# Altium project TP1_NODO_WIFI_R0.PrjPcb
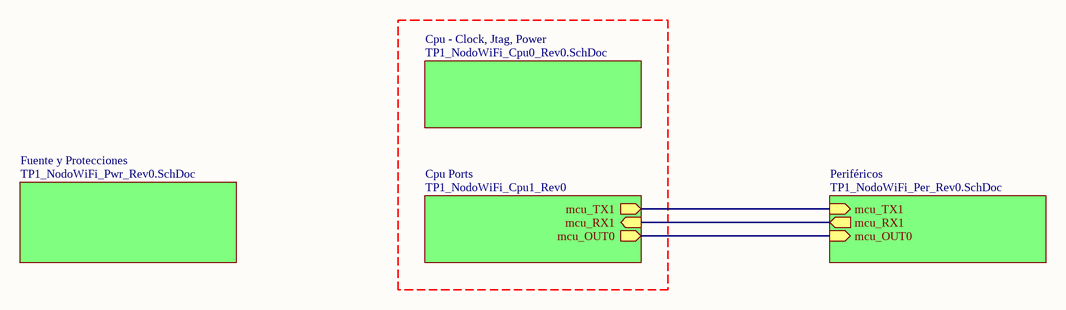
[diagram p0: TP1_NodoWiFi_blk_Rev0.SchDoc]
5 sheets, 52 parts. Net scope: hierarchical (ports join the sheet entries above them; power ports are global).
Board files: TP1_NodoWiFi_Rev0.PcbDoc, TP1_NodoWiFi_Rev0_v22_panel.PcbDoc
Sheets:
  TP1_NodoWiFi_blk_Rev0.SchDoc
    Fuente y Protecciones = TP1_NodoWiFi_Pwr_Rev0.SchDoc
    Cpu Ports = TP1_NodoWiFi_Cpu1_Rev0.SchDoc
    Cpu - Clock, Jtag, Power = TP1_NodoWiFi_Cpu0_Rev0.SchDoc
    Periféricos = TP1_NodoWiFi_Per_Rev0.SchDoc

## Sheet TP1_NodoWiFi_blk_Rev0.SchDoc: TP1 Nodo WiFi blk Rev0
size A4; Author: Alejandro Dario Sobral; SheetNumber: 1; SheetTotal: 5

### Sub-sheets
Cpu - Clock, Jtag, Power = TP1_NodoWiFi_Cpu0_Rev0.SchDoc: no entries
Cpu Ports = TP1_NodoWiFi_Cpu1_Rev0: mcu_TX1 (out), mcu_RX1 (in), mcu_OUT0 (out)
Fuente y Protecciones = TP1_NodoWiFi_Pwr_Rev0.SchDoc: no entries
Periféricos = TP1_NodoWiFi_Per_Rev0.SchDoc: mcu_TX1 (in), mcu_RX1 (out), mcu_OUT0 (in)

### Nets
mcu_OUT0: sheet Cpu Ports/mcu_OUT0, sheet Periféricos/mcu_OUT0
mcu_RX1: sheet Cpu Ports/mcu_RX1, sheet Periféricos/mcu_RX1
mcu_TX1: sheet Cpu Ports/mcu_TX1, sheet Periféricos/mcu_TX1

### Notes on the sheet
- Title:
- Size:
- Author:
- A4
- Sheet
- of
- Revision:
- File:
- Date:

## Sheet TP1_NodoWiFi_Pwr_Rev0.SchDoc: Tp1 NodoWifi Pwr Rev0
size A4; Author: Alejandro Darío Sobral; SheetNumber: 3; SheetTotal: 5
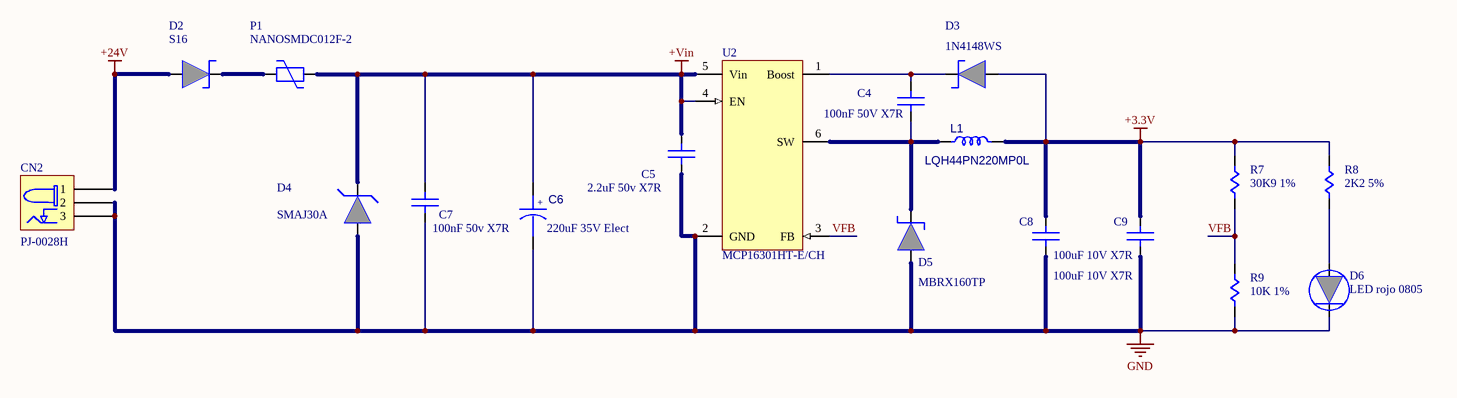
[diagram p1: TP1_NodoWiFi_Pwr_Rev0.SchDoc]

### Parts
C4  100nF 50V X7R  [C_0805]
C5  2.2uF 50v X7R  [C_0805]
C6  220uF 35V Elect
C7  100nF 50v X7R  [C_0805]
C8  100uF 10V X7R  [C_0805]
C9  100uF 10V X7R  [C_0805]
CN2  PJ-0028H  [PJ-002BH]
D2  S16  [Diode SOD-123]
D3  1N4148WS  [Diode SOD-323]
D4  SMAJ30A  [DO-214AC]
D5  MBRX160TP  [Diode SOD-123]
D6  LED rojo 0805  [D_0805]
L1  LQH44PN220MP0L
P1  NANOSMDC012F-2  [Polyswitch 1206]
R7  30K9 1%  [R_0805]
R8  2K2 5%  [R_0805]
R9  10K 1%  [R_0805]
U2  MCP16301HT-E/CH  [IC SOT23-6]

### Nets
+3.3V: C8.2(Cap) C9.2(Cap) D3.1(Cap) L1.2 R7.2(Cap) R8.2(Cap)
+24V: CN2.1 D2.1(Cap)
+Vin: C5.2(Cap) C6.1 C7.2(Cap) D4.2(Cap) P1.1(Cap) U2.4(EN) U2.5(Vin)
GND: C5.1(Cap) C6.2 C7.1(Cap) C8.1(Cap) C9.1(Cap) CN2.2 CN2.3 D4.1(Cap) D5.1(Cap) D6.2(Cap) R9.1(Cap) U2.2(GND)
VFB: R7.1(Cap) R9.2(Cap) U2.3(FB)
NetC4_1: C4.1(Cap) D5.2(Cap) L1.1 U2.6(SW)
NetC4_2: C4.2(Cap) D3.2(Cap) U2.1(Boost)
NetD2_2: D2.2(Cap) P1.2(Cap)
NetD6_1: D6.1(Cap) R8.1(Cap)

### Notes on the sheet
- Title:
- Size:
- Author:
- A4
- Sheet
- of
- Revision:
- File:
- Date:
- (in symbol CAP_P) +

### Library data of the parts
C4 C5 C7-C9 = Capacitor_NoP: capacitor no polarizado
C6 = CAP_P: Polarized Capacitor
CN2 = PJ-0028H: Conector PJ
D2 D3 D5 = Diodo Schottky: Schottky
D4 = Diodo Zener: Zener
D6 = Diodo LED: LED
L1 = IND: Inductor
P1 = Poly Switch
R7-R9 = Resistencia: Resistor
U2 = MCP16301: IC_DC/DC Buck controler

## Sheet TP1_NodoWiFi_Cpu1_Rev0.SchDoc: TP1 NodoWifi Cpu1 Rev0
size A4; Author: Alejandro Darío Sobral; SheetNumber: 5; SheetTotal: 5
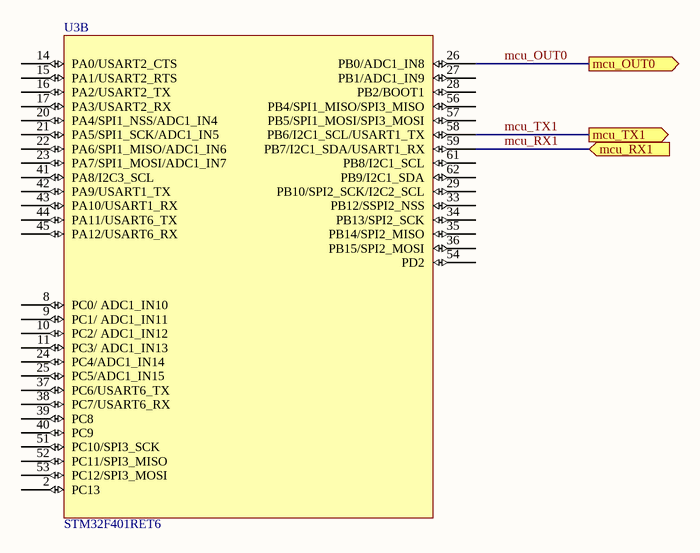
[diagram p2: TP1_NodoWiFi_Cpu1_Rev0.SchDoc]

### Parts
U3  STM32F401RET6  [LQFP_64]  (part B of 2)

### Ports
mcu_OUT0 (out, see TP1_NodoWiFi_blk_Rev0[3B], TP1_NodoWiFi_Per_Rev0[1C]), mcu_RX1 (in, see TP1_NodoWiFi_blk_Rev0[3B], TP1_NodoWiFi_Per_Rev0[3A]), mcu_TX1 (out, see TP1_NodoWiFi_blk_Rev0[3B], TP1_NodoWiFi_Per_Rev0[3A])

### Nets
mcu_OUT0: U3.26(PB0/ADC1_IN8) ; port mcu_OUT0
mcu_RX1: U3.59(PB7/I2C1_SDA/USART1_RX) ; port mcu_RX1
mcu_TX1: U3.58(PB6/I2C1_SCL/USART1_TX) ; port mcu_TX1

Not connected (* = marked no-connect by the designer): U3 2(PC13) 8(PC0/_ADC1_IN10) 9(PC1/_ADC1_IN11) 10(PC2/_ADC1_IN12) 11(PC3/_ADC1_IN13) 14(PA0/USART2_CTS) 15(PA1/USART2_RTS) 16(PA2/USART2_TX) 17(PA3/USART2_RX) 20(PA4/SPI1_NSS/ADC1_IN4) 21(PA5/SPI1_SCK/ADC1_IN5) 22(PA6/SPI1_MISO/ADC1_IN6) 23(PA7/SPI1_MOSI/ADC1_IN7) 24(PC4/ADC1_IN14) 25(PC5/ADC1_IN15) 27(PB1/ADC1_IN9) 28(PB2/BOOT1) 29(PB10/SPI2_SCK/I2C2_SCL) 33(PB12/SSPI2_NSS) 34(PB13/SPI2_SCK) 35(PB14/SPI2_MISO) 36(PB15/SPI2_MOSI) 37(PC6/USART6_TX) 38(PC7/USART6_RX) 39(PC8) 40(PC9) 41(PA8/I2C3_SCL) 42(PA9/USART1_TX) 43(PA10/USART1_RX) 44(PA11/USART6_TX) 45(PA12/USART6_RX) 51(PC10/SPI3_SCK) 52(PC11/SPI3_MISO) 53(PC12/SPI3_MOSI) 54(PD2) 56(PB4/SPI1_MISO/SPI3_MISO) 57(PB5/SPI1_MOSI/SPI3_MOSI) 61(PB8/I2C1_SCL) 62(PB9/I2C1_SDA)

### Notes on the sheet
- Title:
- Size:
- Author:
- A4
- Sheet
- of
- Revision:
- File:
- Date:

### Library data of the parts
U3 = STM32F401RE

## Sheet TP1_NodoWiFi_Cpu0_Rev0.SchDoc: TP1 NodoWiFi Cpu0 Rev0
size A4; Author: Alejandro Darío Sobral; SheetNumber: 4; SheetTotal: 5
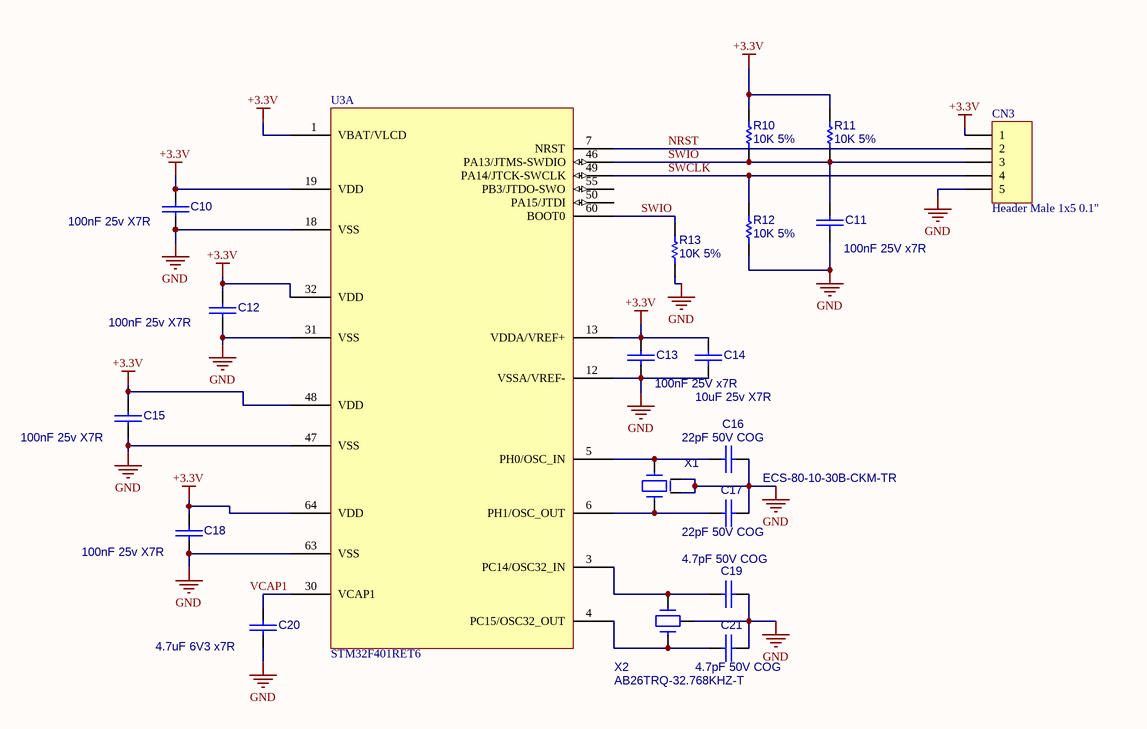
[diagram p3: TP1_NodoWiFi_Cpu0_Rev0.SchDoc]

### Parts
C10  100nF 25v X7R  [C_0805]
C11  100nF 25V x7R  [C_0805]
C12  100nF 25v X7R  [C_0805]
C13  100nF 25V x7R  [C_0805]
C14  10uF 25v X7R  [C_0805]
C15  100nF 25v X7R  [C_0805]
C16  22pF 50V COG  [C_0805]
C17  22pF 50V COG  [C_0805]
C18  100nF 25v X7R  [C_0805]
C19  4.7pF 50V COG  [C_0805]
C20  4.7uF 6V3 x7R  [C_0805]
C21  4.7pF 50V COG  [C_0805]
CN3  Header Male 1x5 0.1"  [Header_M_1x5_0.1"]
R10  10K 5%  [R_0805]
R11  10K 5%  [R_0805]
R12  10K 5%  [R_0805]
R13  10K 5%  [R_0805]
U3  STM32F401RET6  [LQFP_64]  (part A of 2)
X1  ECS-80-10-30B-CKM-TR  [ABM3C]
X2  AB26TRQ-32.768KHZ-T  [AB26TQF]

### Nets
+3.3V: C10.1 C12.1 C13.1 C14.1 C15.1 C18.1 CN3.1 R10.2 R11.2 U3.1(VBAT/VLCD) U3.13(VDDA/VREF+) U3.19(VDD) U3.32(VDD) U3.48(VDD) U3.64(VDD)
GND: C10.2 C11.2 C12.2 C13.2 C14.2 C15.2 C16.2 C17.2 C18.2 C19.2 C20.2 C21.2 CN3.5 R12.1 R13.1 U3.12(VSSA/VREF-) U3.18(VSS) U3.31(VSS) U3.47(VSS) U3.63(VSS) X1.2 X1.4 X2.3
NRST: CN3.2 U3.7(NRST)
SWCLK: CN3.4 R12.2 U3.49(PA14/JTCK-SWCLK)
SWIO: C11.1 CN3.3 R10.1 R11.1 R13.2 U3.46(PA13/JTMS-SWDIO) U3.60(BOOT0)
NetC16_1: C16.1 U3.5(PH0/OSC_IN) X1.1
NetC17_1: C17.1 U3.6(PH1/OSC_OUT) X1.3
NetC19_1: C19.1 U3.3(PC14/OSC32_IN) X2.2
NetC20_1: C20.1 U3.30(VCAP1)
NetC21_1: C21.1 U3.4(PC15/OSC32_OUT) X2.1

Not connected (* = marked no-connect by the designer): U3 50(PA15/JTDI) 55(PB3/JTDO-SWO)

### Notes on the sheet
- Labels drawn without touching a wire or pin: VCAP1
- Title:
- Size:
- Author:
- A4
- Sheet
- of
- Revision:
- File:
- Date:

### Library data of the parts
C10 C12 C15 C18 = CAP
C11 C13 C14 C16 C17 C19 C21 = CAP: Non Polarized Capacitor
C20 = CAP: 100nF 25v X7R
CN3 = CONN_05P: Connector Generic 5 Vias
R10-R13 = Res1: Resistor
U3 = STM32F401RE
X1 = CRYSTAL_4P: Crystal 4 Vias + GND
X2 = CRYSTAL 3P: Crystal 2 Vias + GND

## Sheet TP1_NodoWiFi_Per_Rev0.SchDoc: TP1 NodoWifi Per Rev0
size A4; Author: Alejandro Darío Sobral; SheetNumber: 2; SheetTotal: 5
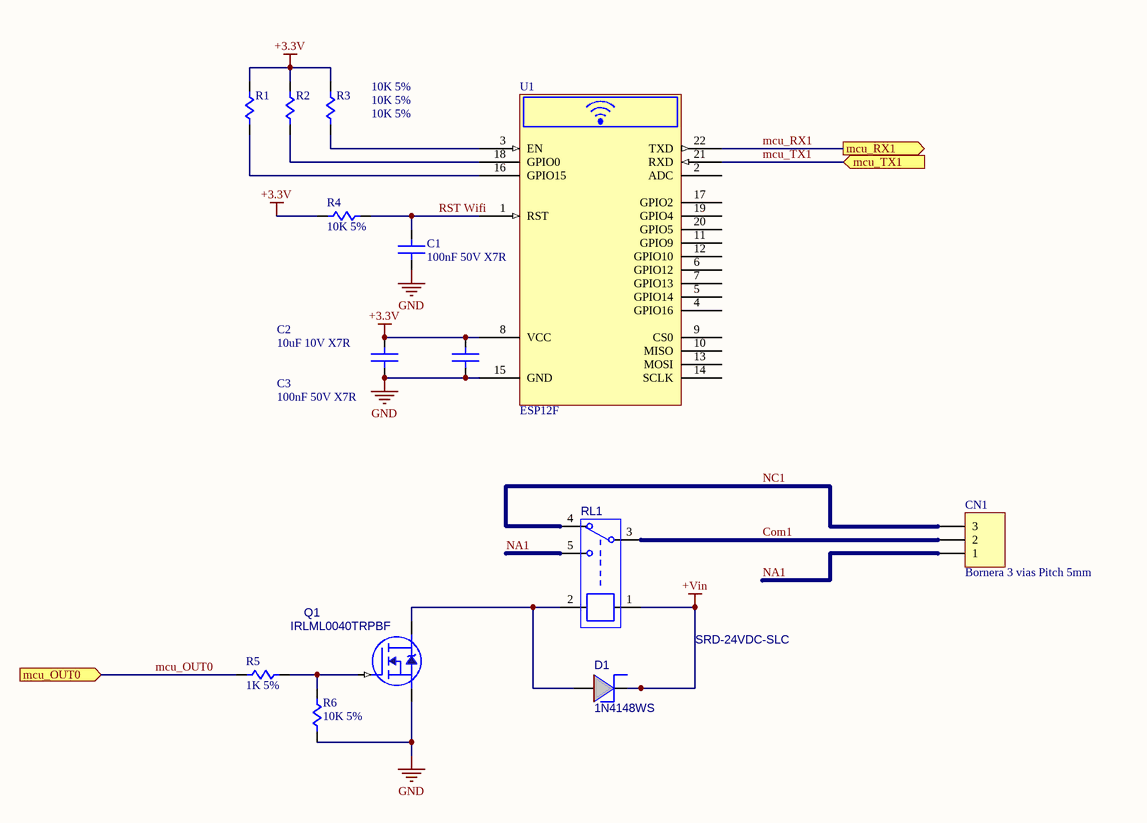
[diagram p4: TP1_NodoWiFi_Per_Rev0.SchDoc]

### Parts
C1  100nF 50V X7R  [C_0805]
C2  10uF 10V X7R  [C_0805]
C3  100nF 50V X7R  [C_0805]
CN1  Bornera 3 vias Pitch 5mm  [Terminal Block]
D1  1N4148WS
Q1  IRLML0040TRPBF  [IC SOT-23]
R1  10K 5%  [R_0805]
R2  10K 5%  [R_0805]
R3  10K 5%  [R_0805]
R4  10K 5%  [R_0805]
R5  1K 5%  [R_0805]
R6  10K 5%  [R_0805]
RL1  SRD-24VDC-SLC  [Relay 24V]
U1  ESP12F  [ESP12F]

### Ports
mcu_OUT0 (in, see TP1_NodoWiFi_blk_Rev0[3B], TP1_NodoWiFi_Cpu1_Rev0[3B]), mcu_RX1 (out, see TP1_NodoWiFi_blk_Rev0[3B], TP1_NodoWiFi_Cpu1_Rev0[3B]), mcu_TX1 (in, see TP1_NodoWiFi_blk_Rev0[3B], TP1_NodoWiFi_Cpu1_Rev0[3B])

### Nets
+3.3V: C2.2(Cap) C3.2(Cap) R1.2(Cap) R2.2(Cap) R3.2(Cap) R4.2(Cap) U1.8(VCC)
+Vin: D1.2(K) RL1.1
GND: C1.1(Cap) C2.1(Cap) C3.1(Cap) Q1.2(SOURCE) R6.1(Cap) U1.15(GND)
Com1: CN1.2 RL1.3
mcu_OUT0: R5.2(Cap) ; port mcu_OUT0
mcu_RX1: U1.22(TXD) ; port mcu_RX1
mcu_TX1: U1.21(RXD) ; port mcu_TX1
NA1: CN1.1 RL1.5
NC1: CN1.3 RL1.4
RST Wifi: C1.2(Cap) R4.1(Cap) U1.1(RST)
NetD1_1: D1.1(A) Q1.3(DRAIN) RL1.2
NetQ1_1: Q1.1(GATE) R5.1(Cap) R6.2(Cap)
NetR1_1: R1.1(Cap) U1.16(GPIO15)
NetR2_1: R2.1(Cap) U1.18(GPIO0)
NetR3_1: R3.1(Cap) U1.3(EN)

Not connected (* = marked no-connect by the designer): U1 2(ADC) 4(GPIO16) 5(GPIO14) 6(GPIO12) 7(GPIO13) 9(CS0) 10(MISO) 11(GPIO9) 12(GPIO10) 13(MOSI) 14(SCLK) 17(GPIO2) 19(GPIO4) 20(GPIO5)

### Notes on the sheet
- Title:
- Size:
- Author:
- A4
- Sheet
- of
- Revision:
- File:
- Date:

### Library data of the parts
C1-C3 = Capacitor_NoP: capacitor no polarizado
CN1 = CONN_03P: Connector Generic 3 Vias
D1 = DIODO_SH: Diode Shottky
Q1 = N_MOSFET_SOT23: Mosfet N-Ch
R1-R6 = Resistencia: Resistor
RL1 = RELAY SPDT
U1 = ESP12F Wifi Module: Wifi Module

## Nets that join several sheets
+3.3V: TP1_NodoWiFi_Pwr_Rev0 (6 pins), TP1_NodoWiFi_Cpu0_Rev0 (15 pins), TP1_NodoWiFi_Per_Rev0 (7 pins)
+Vin: TP1_NodoWiFi_Pwr_Rev0 (7 pins), TP1_NodoWiFi_Per_Rev0 (D1.2 RL1.1)
GND: TP1_NodoWiFi_Pwr_Rev0 (12 pins), TP1_NodoWiFi_Cpu0_Rev0 (23 pins), TP1_NodoWiFi_Per_Rev0 (6 pins)
mcu_OUT0: TP1_NodoWiFi_Cpu1_Rev0 (U3.26), TP1_NodoWiFi_Per_Rev0 (R5.2)
mcu_RX1: TP1_NodoWiFi_Cpu1_Rev0 (U3.59), TP1_NodoWiFi_Per_Rev0 (U1.22)
mcu_TX1: TP1_NodoWiFi_Cpu1_Rev0 (U3.58), TP1_NodoWiFi_Per_Rev0 (U1.21)